# Altium schematic sheet power_supply.SchDoc: Hall / Main Board / Power Supply
size A4; DocumentNumber: 6; SheetNumber: 6; SheetTotal: 7
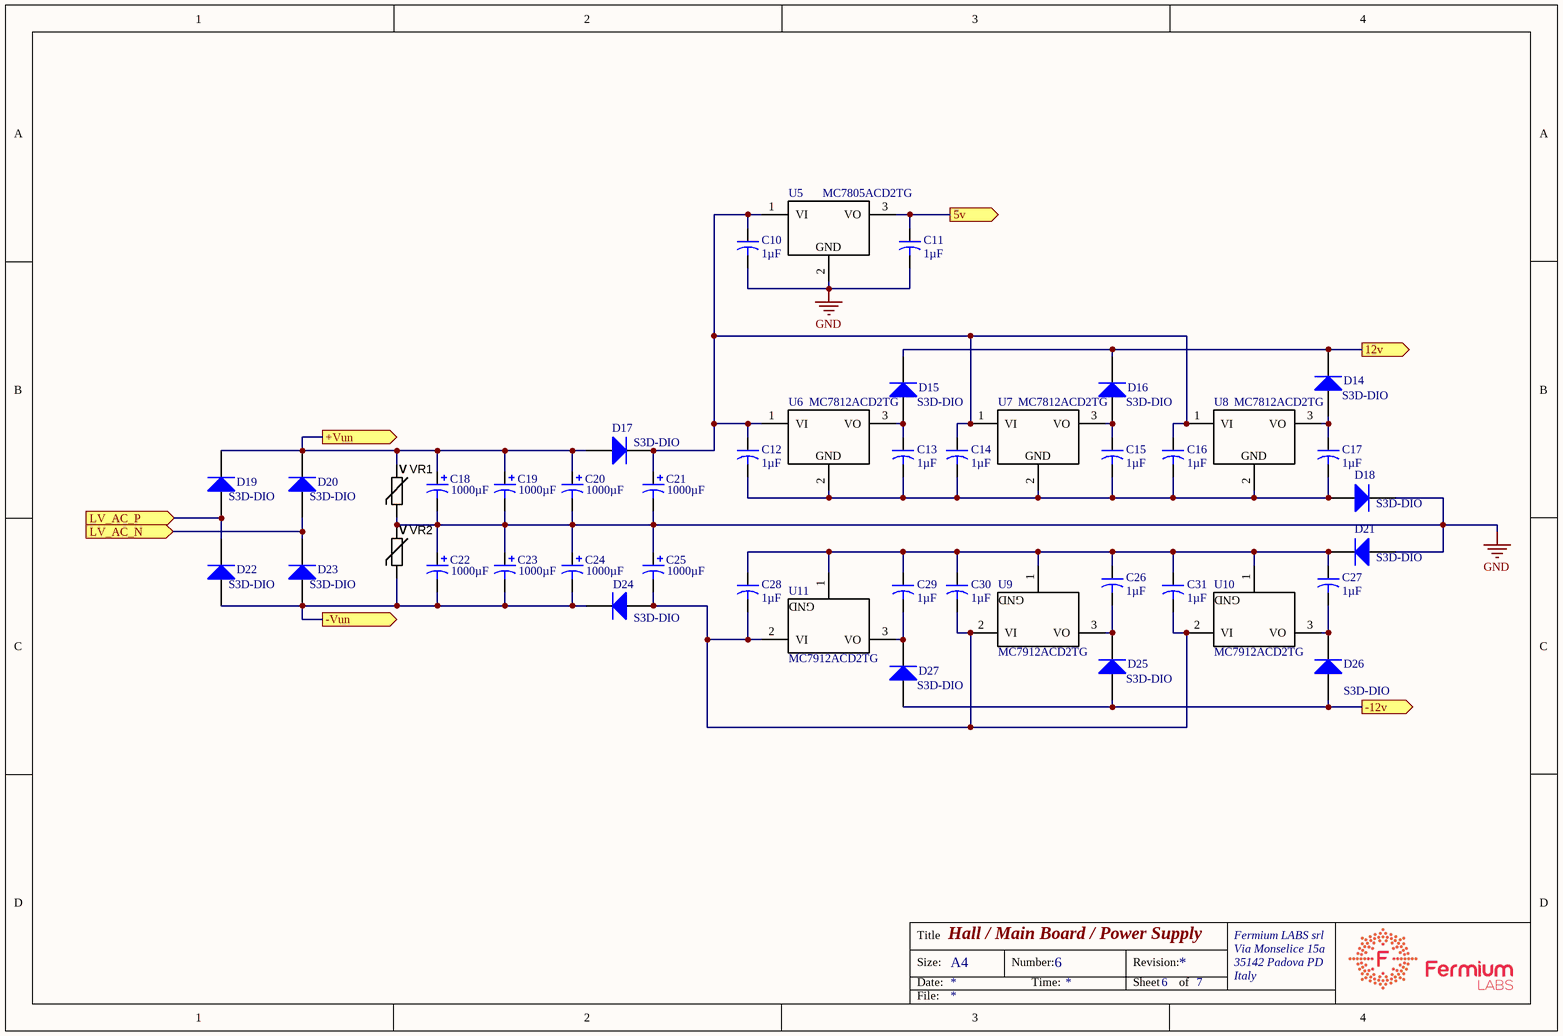
[diagram p0: power_supply.SchDoc]

## Parts
C10  Capacitance: 1µF  [CAP 0805/2012]
C11  Capacitance: 1µF  [CAP 0805/2012]
C12  Capacitance: 1µF  [CAP 0805/2012]
C13  Capacitance: 1µF  [CAP 0805/2012]
C14  Capacitance: 1µF  [CAP 0805/2012]
C15  Capacitance: 1µF  [CAP 0805/2012]
C16  Capacitance: 1µF  [CAP 0805/2012]
C17  Capacitance: 1µF  [CAP 0805/2012]
C18  Capacitance: 1000µF  [CAPE5.0mm]
C19  Capacitance: 1000µF  [CAPE5.0mm]
C20  Capacitance: 1000µF  [CAPE5.0mm]
C21  Capacitance: 1000µF  [CAPE5.0mm]
C22  Capacitance: 1000µF  [CAPE5.0mm]
C23  Capacitance: 1000µF  [CAPE5.0mm]
C24  Capacitance: 1000µF  [CAPE5.0mm]
C25  Capacitance: 1000µF  [CAPE5.0mm]
C26  Capacitance: 1µF  [CAP 0805/2012]
C27  Capacitance: 1µF  [CAP 0805/2012]
C28  Capacitance: 1µF  [CAP 0805/2012]
C29  Capacitance: 1µF  [CAP 0805/2012]
C30  Capacitance: 1µF  [CAP 0805/2012]
C31  Capacitance: 1µF  [CAP 0805/2012]
D14  Supplier Part Number 1: S3D-DIO  [DIODE-SMC]
D15  Supplier Part Number 1: S3D-DIO  [DIODE-SMC]
D16  Supplier Part Number 1: S3D-DIO  [DIODE-SMC]
D17  Supplier Part Number 1: S3D-DIO  [DIODE-SMC]
D18  Supplier Part Number 1: S3D-DIO  [DIODE-SMC]
D19  Supplier Part Number 1: S3D-DIO  [DIODE-SMC]
D20  Supplier Part Number 1: S3D-DIO  [DIODE-SMC]
D21  Supplier Part Number 1: S3D-DIO  [DIODE-SMC]
D22  Supplier Part Number 1: S3D-DIO  [DIODE-SMC]
D23  Supplier Part Number 1: S3D-DIO  [DIODE-SMC]
D24  Supplier Part Number 1: S3D-DIO  [DIODE-SMC]
D25  Supplier Part Number 1: S3D-DIO  [DIODE-SMC]
D26  Supplier Part Number 1: S3D-DIO  [DIODE-SMC]
D27  Supplier Part Number 1: S3D-DIO  [DIODE-SMC]
U5  Supplier Part Number 1: MC7805ACD2TG  [D2PAK-3]
U6  Supplier Part Number 1: MC7812ACD2TG  [D2PAK-3]
U7  Supplier Part Number 1: MC7812ACD2TG  [D2PAK-3]
U8  Supplier Part Number 1: MC7812ACD2TG  [D2PAK-3]
U9  Supplier Part Number 1: MC7912ACD2TG  [D2PAK-3]
U10  Supplier Part Number 1: MC7912ACD2TG  [D2PAK-3]
U11  Supplier Part Number 1: MC7912ACD2TG  [D2PAK-3]
VR1  (no value)  [CAP 1206/3216 - 1.8MM]
VR2  (no value)  [CAP 1206/3216 - 1.8MM]

## Ports
5v (out), 12v (out), +Vun (out), -12v (out), -Vun (out), LV_AC_N (in), LV_AC_P (in)

## Nets
GND: C10.2 C11.2 C18.2 C19.2 C20.2 C21.2 C22.1 C23.1 C24.1 C25.1 D18.K D21.A U5.2 VR1.2 VR2.1
5v: C11.1 U5.3(VO) ; port 5v
12v: D14.K D15.K D16.K ; port 12v
+Vun: C18.1 C19.1 C20.1 D17.A D19.K D20.K VR1.1 ; port +Vun
-12v: D25.A D26.A D27.A ; port -12v
-Vun: C22.2 C23.2 C24.2 D22.A D23.A D24.K VR2.2 ; port -Vun
LV_AC_N: D20.A D23.K ; port LV_AC_N
LV_AC_P: D19.A D22.K ; port LV_AC_P
NetC10_1: C10.1 C12.1 C14.1 C16.1 C21.1 D17.K U5.1(VI) U6.1(VI) U7.1(VI) U8.1(VI)
NetC12_2: C12.2 C13.2 C14.2 C15.2 C16.2 C17.2 D18.A U6.2 U7.2 U8.2
NetC13_1: C13.1 D15.A U6.3(VO)
NetC15_1: C15.1 D16.A U7.3(VO)
NetC17_1: C17.1 D14.A U8.3(VO)
NetC25_2: C25.2 C28.2 C30.2 C31.2 D24.A U9.2(VI) U10.2(VI) U11.2(VI)
NetC26_1: C26.1 C27.1 C28.1 C29.1 C30.1 C31.1 D21.K U9.1 U10.1 U11.1
NetC26_2: C26.2 D25.K U9.3(VO)
NetC27_2: C27.2 D26.K U10.3(VO)
NetC29_2: C29.2 D27.K U11.3(VO)

## Notes on the sheet
- Title
- Size:
- Date:
- A4
- Number:
- Time:
- Revision:
- Sheet
- of
- Fermium LABS srl
- Via Monselice 15a
- 35142 Padova PD
- Italy
- File:
- (in symbol L7805-TO220) GND
- (in symbol L7815-TO220) GND
- (in symbol L7915-TO220) GND
- (in symbol Varistor_MOV) V

## Library data of the parts
C10-C17 C26-C31 = Cap2: Capacitor; Manufacturer: SAMSUNG; Manufacturer Part Number: CL21B105KAFNNNE; Unit: pcs; SuppliedAmount: 0; MinAmount: 100; Capacitor type: ceramic; Capacitor kind: MLCC; Operating voltage: 25V; Dielectric: X7R; Tolerance: ±10%; Case - inch: 0805; Case - mm: 2012; Pads: 2 SMD; Published: 23-Sep-2002; PackageReference: CAPR5-4X5; Publisher: Altium Limited; PackageDescription: Capacitor; 2 Leads; Supplier 1: TME; Supplier Part Number 1: CL21B105KAFNNNE; Category: 0805 MLCC SMD Capacitors; Stock 1: 56790; Pricing 1: 100=0.0108, 300=0.00924, 1000=0.00748, 2000=0.006, 6000=0.0058 (EUR); Weight: 0.039; Multiples: 100; Mounting: SMD; Operating temperature: -55...125°C; Price Type: NET; ComponentLink1URL: http://static.tme.eu/products_pics/d/b/b/dbbd93eaf25225110ca26eb66da77328/58538.jpg; ComponentLink1Description: http://static.tme.eu/products_pics/d/b/b/dbbd93eaf25225110ca26eb66da77328/58538.jpg
C18-C24 = Cap Pol1: capacitor , electrolytic; Manufacturer: United Chemi-Con; Manufacturer Part Number: EKYB250ELL102MJ20S; Pads: 2 THT; Description: Aluminum Electrolytic Capacitors - Leaded 25V 1000uF 20% Tol.; Featured Product: United Chemi-Con - KYB Series Aluminum Electrolytic Capacitors; Tolerance: ±20%; Voltage Rating: 25V; Lifetime @ Temp.: 10000 Hrs @ 105°C; Ripple Current: 1.65A; Impedance: 37 mOhm; Online Catalog: KYB Series; Other Names: 565-3892; Supplier 1: Mouser; Supplier Part Number 1: 661-EKYB250E102MJ20S; Stock 1: 908; Pricing 1: 1=0.69, 10=0.507, 50=0.387, 100=0.348, 1000=0.232, 10000=0.187 (USD); Standard Package: 2,000; Category: Capacitors; Family: Aluminum Capacitors; Series: KYB; Packaging: Bulk; ESR (Equivalent Series Resistance): -; Operating Temperature: -40°C ~ 105°C; Polarization: -; Applications: General Purpose; Lead Spacing: 0.197" (5.00mm); Size / Dimension: 0.394" Dia (10.00mm); Height - Seated (Max): 0.846" (21.50mm); Surface Mount Land Size: -; Mounting Type: Through Hole; Package / Case: Radial, Can; ComponentLink1URL: https://datasheet.ciiva.com/31837/al-kyb-bulletin826a-e-121112-31837781.pdf; ComponentLink1Description: https://datasheet.ciiva.com/31837/al-kyb-bulletin826a-e-121112-31837781.pdf
C25 = Cap Pol1: capacitor , electrolytic; Manufacturer: United Chemi-Con; Manufacturer Part Number: EKYB250ELL102MJ20S; Description: Aluminum Electrolytic Capacitors - Leaded 25V 1000uF 20% Tol.; Featured Product: United Chemi-Con - KYB Series Aluminum Electrolytic Capacitors; Tolerance: ±20%; Voltage Rating: 25V; Lifetime @ Temp.: 10000 Hrs @ 105°C; Ripple Current: 1.65A; Impedance: 37 mOhm; Online Catalog: KYB Series; Other Names: 565-3892; Supplier 1: Mouser; Supplier Part Number 1: 661-EKYB250E102MJ20S; Stock 1: 908; Pricing 1: 1=0.69, 10=0.507, 50=0.387, 100=0.348, 1000=0.232, 10000=0.187 (USD); Standard Package: 2,000; Category: Capacitors; Family: Aluminum Capacitors; Series: KYB; Packaging: Bulk; ESR (Equivalent Series Resistance): -; Operating Temperature: -40°C ~ 105°C; Polarization: -; Applications: General Purpose; Lead Spacing: 0.197" (5.00mm); Size / Dimension: 0.394" Dia (10.00mm); Height - Seated (Max): 0.846" (21.50mm); Surface Mount Land Size: -; Mounting Type: Through Hole; Package / Case: Radial, Can; ComponentLink1URL: https://datasheet.ciiva.com/31837/al-kyb-bulletin826a-e-121112-31837781.pdf; ComponentLink1Description: https://datasheet.ciiva.com/31837/al-kyb-bulletin826a-e-121112-31837781.pdf
D14-D27 = Diode 1N4007: Diode rectifier 1A; Manufacturer: DIOTEC SEMICONDUCTOR; Manufacturer Part Number: S3D; Pads: 2 SMD; Supplier 1: TME; Case: DO214AB
U5 = L7805-TO220: Voltage regulator, 5V; Manufacturer: ON SEMICONDUCTOR; Unit: pcs; SuppliedAmount: 0; MinAmount: 2; Multiples: 1; Integrated circuit type: voltage stabiliser; Kind of voltage regulator: fixed; Output current: 1A; Pads: 3 SMD; Supplier 1: TME; Manufacturer Part Number: MC7805ACD2TG; Category: Unregulated Voltage Regulators; Stock 1: 245; Pricing 1: 2=0.45, 10=0.42, 50=0.38, 250=0.322 (EUR); Weight: 2.18; Output voltage: 5V; Case: D2PAK; Mounting: SMD; Package type: tube; Price Type: NET; ComponentLink1URL: http://static.tme.eu/products_pics/e/a/8/ea8bf400c57f85e1fa510dcd027ce484/59301.jpg; ComponentLink1Description: http://static.tme.eu/products_pics/e/a/8/ea8bf400c57f85e1fa510dcd027ce484/59301.jpg
U6-U8 = L7815-TO220: Voltage regulator, 15V; Manufacturer: ON SEMICONDUCTOR; Unit: pcs; SuppliedAmount: 0; MinAmount: 1; Integrated circuit type: voltage stabiliser; Kind of voltage regulator: fixed; Output voltage: 12V; Output current: 1A; Pads: 3 SMD; Supplier 1: TME; Manufacturer Part Number: MC7812ACD2TG; Category: Unregulated Voltage Regulators; Stock 1: 415; Pricing 1: 1=0.5, 5=0.449, 25=0.41, 100=0.357, 500=0.299 (EUR); Weight: 1.997; Multiples: 1; Case: D2PAK; Mounting: SMD; Package type: tube; Price Type: NET; ComponentLink1URL: http://static.tme.eu/products_pics/e/a/8/ea8bf400c57f85e1fa510dcd027ce484/59301.jpg; ComponentLink1Description: http://static.tme.eu/products_pics/e/a/8/ea8bf400c57f85e1fa510dcd027ce484/59301.jpg
U9-U11 = L7915-TO220: Voltage regulator-15.0V; Manufacturer: ON SEMICONDUCTOR; Unit: pcs; SuppliedAmount: 0; MinAmount: 1; Integrated circuit type: voltage stabiliser; Kind of voltage regulator: fixed; Output voltage: -12V; Output current: 1A; Pads: 3 SMD; Supplier 1: TME; Manufacturer Part Number: MC7912ACD2TG; Category: Unregulated Voltage Regulators; Stock 1: 441; Pricing 1: 1=0.628, 5=0.56, 25=0.465, 100=0.39, 500=0.34 (EUR); Weight: 1.876; Multiples: 1; Case: D2PAK; Mounting: SMD; Package type: tube; Price Type: NET; ComponentLink1URL: http://static.tme.eu/products_pics/e/a/8/ea8bf400c57f85e1fa510dcd027ce484/59301.jpg; ComponentLink1Description: http://static.tme.eu/products_pics/e/a/8/ea8bf400c57f85e1fa510dcd027ce484/59301.jpg
VR1 VR2 = Varistor_MOV: Varistor; Manufacturer: EPCOS; Manufacturer Part Number: B72520T0250K062; Unit: pcs; SuppliedAmount: 0; MinAmount: 5; Multiples: 1; Varistor type: metal-oxide; Max. operating voltage: 25V AC; Energy 2 ms: 1J; Varistor max current 8/20µs: 200A; Power: 8mW; Pads: 2 SMD; Supplier 1: TME; Supplier Part Number 1: B72520T250K62; Category: SMD Varistors; Stock 1: 1646; Pricing 1: 5=0.194, 50=0.158, 100=0.128, 500=0.119, 2000=0.114 (EUR); Weight: 0.058; Mounting: SMD; Case: 1206; Price Type: NET; ComponentLink1URL: http://static.tme.eu/products_pics/c/0/9/c09a96f753270fa18ba9e61c943ff8c8/58311.jpg; ComponentLink1Description: http://static.tme.eu/products_pics/c/0/9/c09a96f753270fa18ba9e61c943ff8c8/58311.jpg